# Altium schematic sheet Miscellaneous.SchDoc: <Project Name>
size A3; Copyright: © Lantiq Deutschland GmbH 2010. All Rights Reserved.; ApprovedBy: <Appr.>; Author: <Author>; CompanyName: Infineon Technologies AG; Engineer: <Rel.>; Organization: Infineon Technologies AG; Address1: COM AC SDC SD3; Address2: Am Campeon 1-12  -  85579 Neubiberg  -  Germany; Address3: 85579 Neubiberg; Address4: Germany; Revision: <Rev.>; Release: RC00; PageSetup: Record=PageOptions|CenterHorizontal=True|CenterVertical=True|PrintScale=1.01|XCorrection=1.00|YCorrection=1.00|PrintKind=0|BorderSize=5000000|LeftOffset=0|BottomOffset=0|Orientation=2|PaperLength=1000|PaperWidth=1000|Scale=100|PaperSource=7|PrintQuality=-4|MediaType=1|DitherType=10|PaperKind=A3|PrintScaleMode=1; Doc_ConfidentialStatus: <Doc_ConfidentialStatus>; Doc_Preliminary: <Doc_Preliminary>
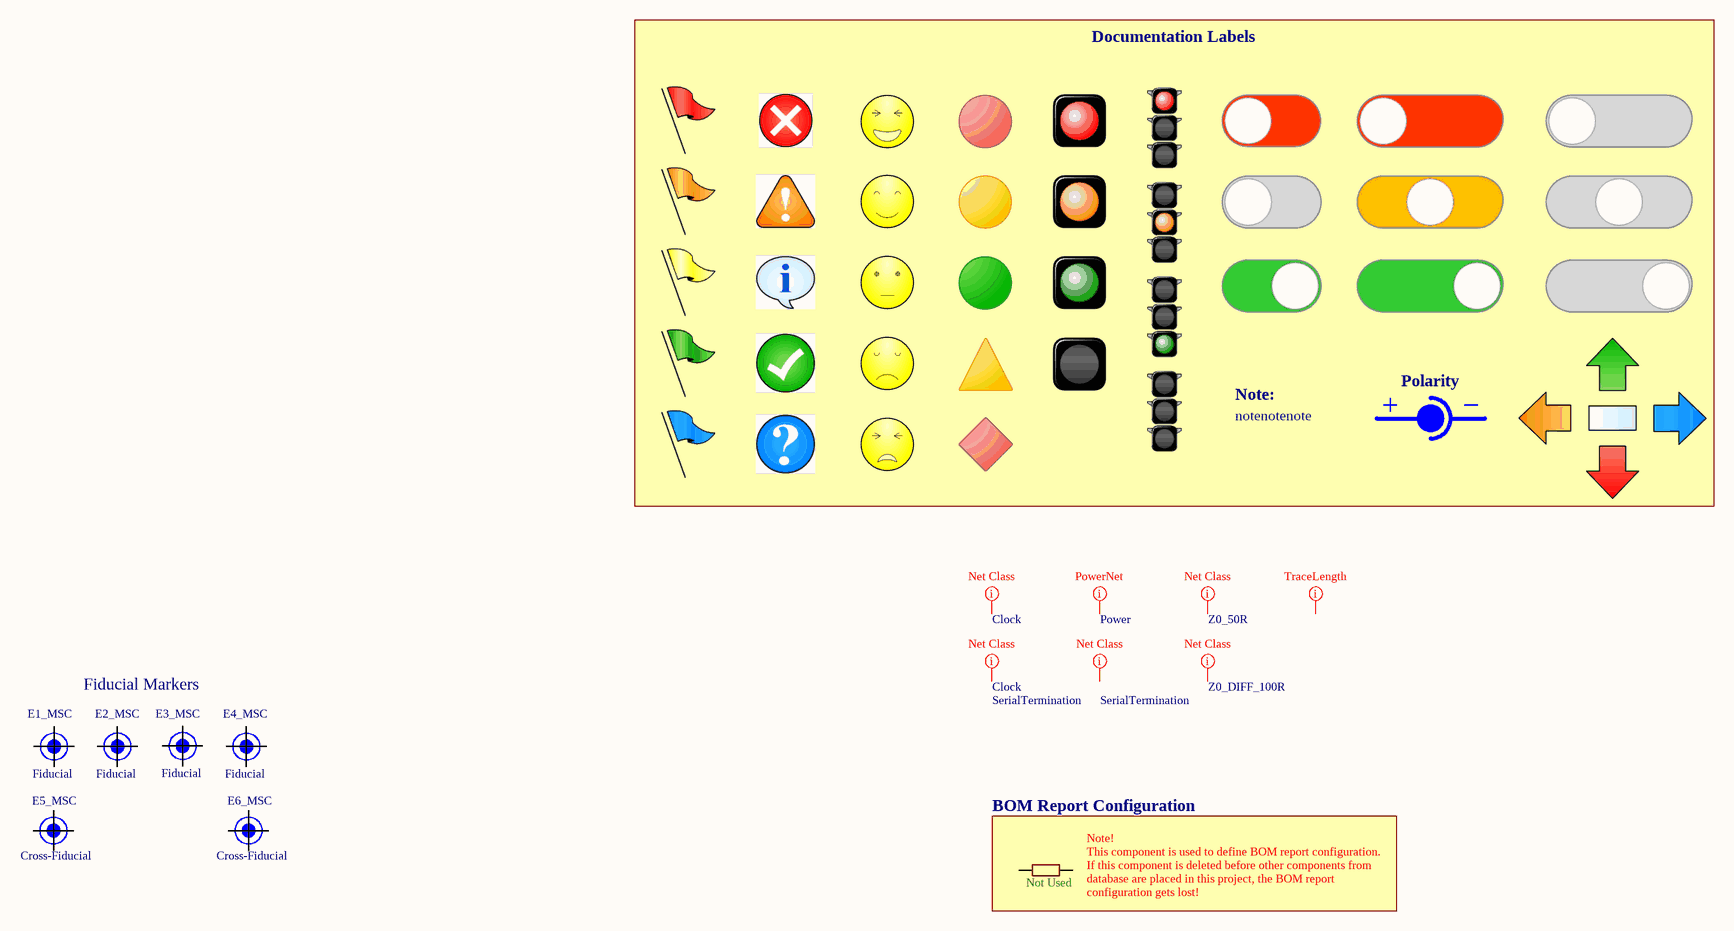
[diagram p0: Miscellaneous.SchDoc]

## Parts
E1_MSC  Fiducial  [fiducial]  (no BOM)
E2_MSC  Fiducial  [fiducial]  (no BOM)
E3_MSC  Fiducial  [fiducial]  (no BOM)
E4_MSC  Fiducial  [fiducial]  (no BOM)
E5_MSC  Cross-Fiducial  [fiducial_cross]  (no BOM)
E6_MSC  Cross-Fiducial  [fiducial_cross]  (no BOM)
Not_Used  0R  [RESC1609X50N]  (value not drawn)

## Blocks framed on the sheet
BOM Report Configuration: Not_Used

## Nets

Not connected (* = marked no-connect by the designer): E1_MSC 1; E2_MSC 1; E3_MSC 1; E4_MSC 1; E5_MSC 1; E6_MSC 1; Not_Used 1 2

## Layout directives
net class Z0_DIFF_100R: (no net found under the mark)
net class TraceLength; rule Length Constraint [Min Length = 0mm    Max Length = 5mm]: (no net found under the mark)
net class SerialTermination; net class Clock: (no net found under the mark)
net class Z0_50R: (no net found under the mark)
net class Power: (no net found under the mark)
net class Clock: (no net found under the mark)
net class SerialTermination: (no net found under the mark)

## Notes on the sheet
- Documentation Labels
- Note:
- notenotenote
- Polarity
- Fiducial Markers
- (near Not_Used) Note!
  This component is used to define BOM report configuration.
  If this component is deleted before other components from
  database are placed in this project, the BOM report
  configuration gets lost!
- Title
- Variant
- Approved
- Date:
- Author:
- Size:
- A3
- Document Name
- Time:
- SVN Revision:
- Rel.
- Rev.
- Sheet
- of

## Library data of the parts
E1_MSC E2_MSC E3_MSC E4_MSC = 416637: Fiducial Mark; Legacy PartNumber: MEC10000008; Manufacturer: Infineon Technologies; Manufacturer Component Status: Active; Alternate View: No; Symbol Type: Fiducial Marker For PCB; Article Number: 416637; Version Number: V01; Legacy DeviceID: MEC_Fiducial_Mark; Combined Parameters: - - -x- -; ComponentStatus: Released; Second Source allowed: Yes; Voltage DC (max): na; Multible Parts: No; Part Type: Mechanical; Temperature min: 0; Temperature max: 0; Temperature Range: Military; ComponentLink1Description: Vendor WebSite; ComponentLink1URL: https://www.infineon.com/; ComponentLink2Description: Datasheet; ComponentLink2URL: http://webnetprod.muc.infineon.com/PCBPortal_Prod/WorkFlows/AltiumComponent/StandardDocumentation?Versionid=416638; Supplier 1: Farnell; Supplier 2: DigiKey; Supplier 3: Mouser; PLMStatus: Active
E5_MSC E6_MSC = 417560: Fiducial Mark; Legacy PartNumber: MEC10000088; Manufacturer: Infineon Technologies; Manufacturer Component Status: Active; Alternate View: No; Symbol Type: Fiducial Marker For PCB; Article Number: 417560; Version Number: V01; Legacy DeviceID: MEC_Fiducial_Cross_Mark; Combined Parameters: - - -x- -; ComponentStatus: Released; Second Source allowed: Yes; Voltage DC (max): na; Multible Parts: No; Part Type: Mechanical; Temperature min: 0; Temperature max: 0; Temperature Range: Military; Automotive Qualified: No; PackageReference: Fiducial Mark 2mm Cross; ComponentLink1Description: Vendor WebSite; ComponentLink1URL: https://www.infineon.com/; ComponentLink2Description: Datasheet; Supplier 1: Farnell; Supplier 2: DigiKey; Supplier 3: Mouser; PLMStatus: Active
Not_Used = 343882: Standard Thick Film Chip Resistor; Multiple Parts: No; Legacy PartNumber: RES01800800; Manufacturer: Vishay; Manufacturer Order Number: CRCW06030000Z0; Manufacturer Component Status: Active; Symbol Type: Resistor; Single; Standard; 2 Pins; Alternate View: Yes; Article Number: 343882; Version Number: V01; Combined Parameters: TCR:-;Tol.:-0R/+0R;Vdc:75V;Idc:2A;P:-; QuickPick: 0R / 0R / 0603; Style: Single; Automotive Qualified: AEC Q200; ComponentStatus: Released; Voltage DC (max): 75V; Legacy DeviceID: RES01800800; Part Type: Resistor; Value: 0R; Tolerance Neg: 0R; Tolerance Pos: 0R; Type: Standard; Technology: Thick Film; Temperature min: -55; Temperature max: 155; Temperature Range: Military; ROHS Compliant: Y; PackageReference: 0603; ComponentLink1Description: Vendor WebSite; ComponentLink1URL: http://www.vishay.com; ComponentLink2Description: Datasheet; ComponentLink2URL: http://webnetprod.muc.infineon.com/PCBPortal_Prod/WorkFlows/AltiumComponent/StandardDocumentation?Versionid=343883; Supplier 1: Farnell; Supplier 2: DigiKey; Supplier Part Number 2: 541-0.0GCT-ND; Supplier 3: Mouser; PLMStatus: Active; Second Source allowed: Yes